# EAGLE design JustStupid (EAGLE 9.3.2)
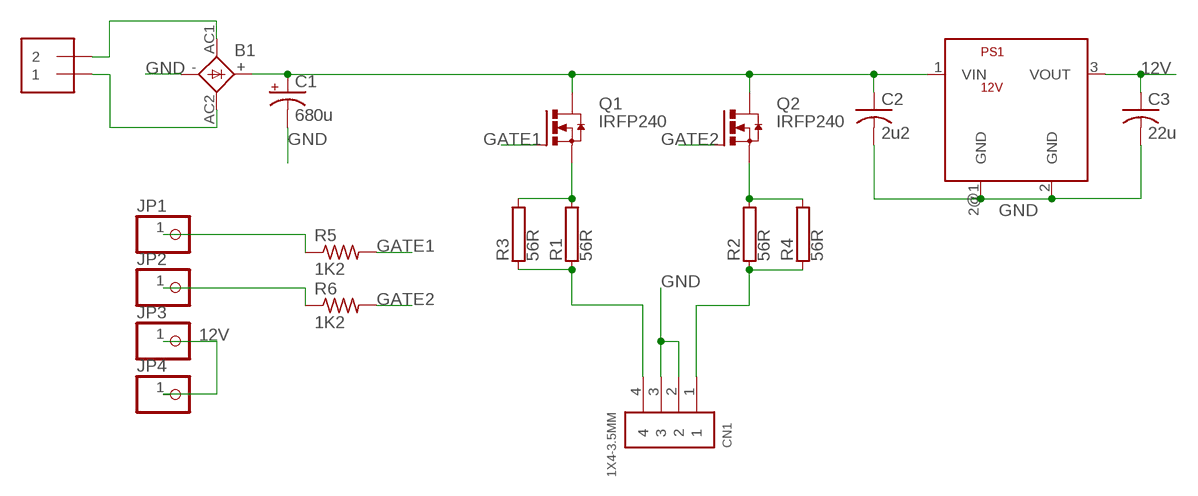
[diagram p0: schematic, sheet 1]

## Parts
ACIN  1X2-3.5MM  [1X2-3.5MM]
B1  KBU  [KBU]
C1  680u  C_POL  [PCPIN_CAP]
C2  2u2  C-USC2220K  [C2220K]
C3  22u  C-USC1206  [C1206]
CN1  1X4-3.5MM  [1X04-3.5MM]
JP1  PINHD-1X1  [1X01]
JP2  PINHD-1X1  [1X01]
JP3  PINHD-1X1  [1X01]
JP4  PINHD-1X1  [1X01]
PS1  12V  NCP785A  [SOT89]
Q1  IRFP240  [TO247BV]
Q2  IRFP240  [TO247BV]
R1  56R  RMG100-V  [TO-247-2V]
R2  56R  RMG100-V  [TO-247-2V]
R3  56R  RMG100-V  [TO-247-2V]
R4  56R  RMG100-V  [TO-247-2V]
R5  1K2  R-US_R1206  [R1206]
R6  1K2  R-US_R1206  [R1206]

## Nets
12V: C3.1 JP3.1 JP4.1 PS1.3(VOUT)
GATE1: Q1.G R5.2
GATE2: Q2.G R6.2
GND [pwr]: B1.- C1.P$1(-) C2.2 C3.2 CN1.2 CN1.3 PS1.2(GND) PS1.2@1(GND)
N$1 [pwr]: ACIN.1 B1.AC2
N$2 [pwr]: ACIN.2 B1.AC1
N$3 [pwr]: B1.+ C1.P$2(+) C2.1 PS1.1(VIN) Q1.D Q2.D
N$4: JP1.1 R5.1
N$5 [pwr]: CN1.4 R1.1 R3.1
N$6 [pwr]: CN1.1 R2.1 R4.1
N$7 [pwr]: Q1.S R1.2 R3.2
N$8 [pwr]: Q2.S R2.2 R4.2
N$9: JP2.1 R6.1

## Library data of the parts
ACIN = adafruit:1X2: 3.5mm Terminal block http://www.ladyada.net/library/pcb/eaglelibrary.html
B1 = rectifier:KBU: DIOTEC RECTIFIER
C1 = TEMP:C_POL
C2 C3 = adafruit:C-US: CAPACITOR, American symbol
CN1 = adafruit:1X4: 4-pin connector
JP1-JP4 = adafruit:PINHD-1X1: Pin header 1x1 for 0.1" spacing With round pins
PS1 = TEMP:NCP785A
Q1 Q2 = transistor-power:IRFP240: HEXFET Power MosFet Source: http://www.irf.com/
R1-R4 = resistor-power:RMG100: TO-247 Power Resistor - RMG 100 Series Source: www.token.com.tw .. power-resistor-rmg100pdf; OC_FARNELL: unknown; OC_NEWARK: unknown
R5 R6 = adafruit:R-US_: RESISTOR, American symbol

## Net classes
1 pwr: width 0.635 mm, drill 0.203 mm, clearance 0.381 mm

## Board
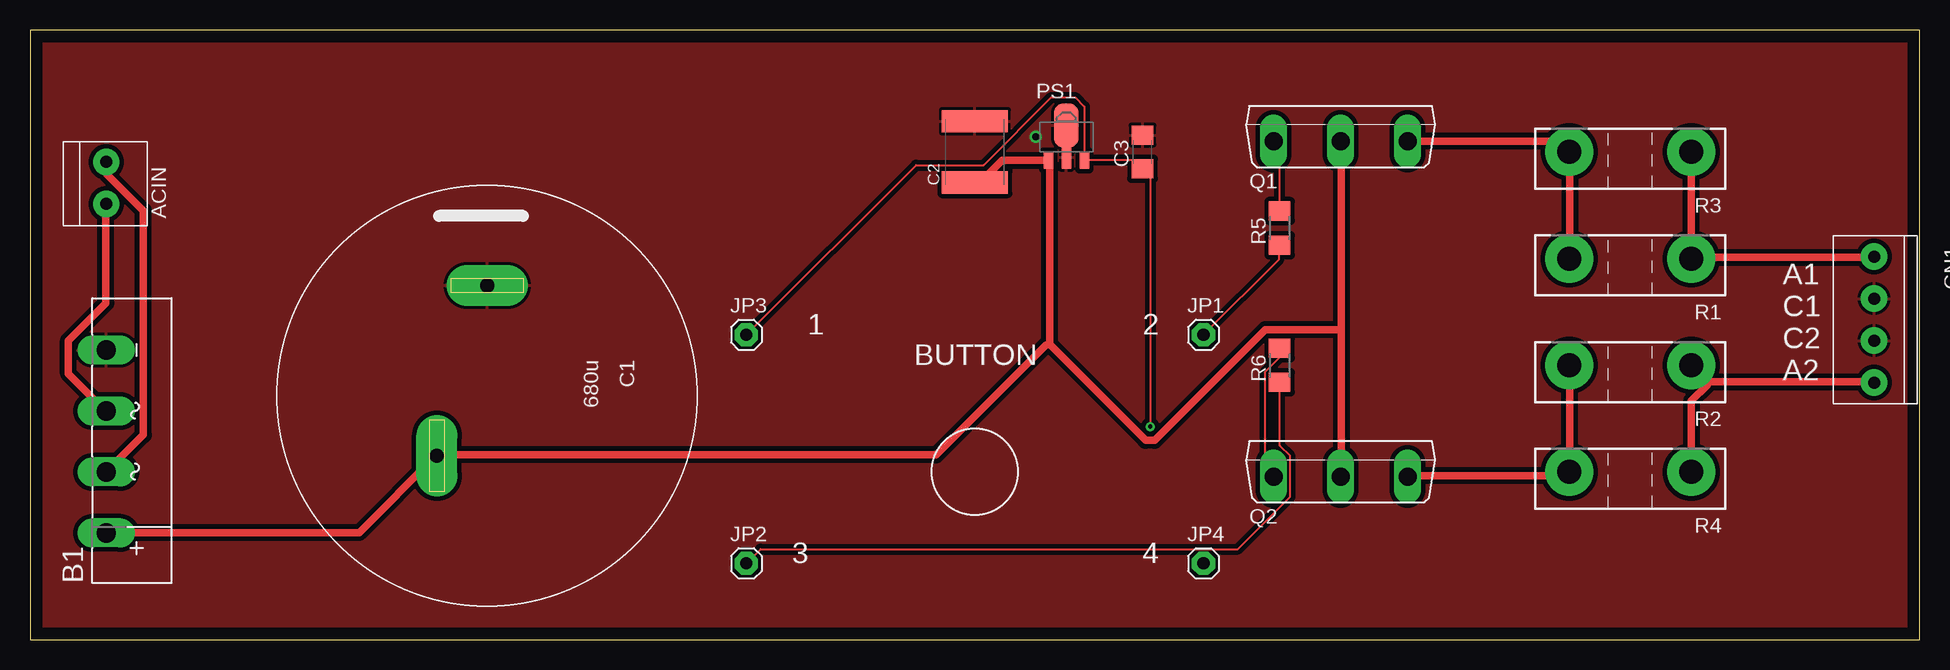
[diagram p1: board, top side]
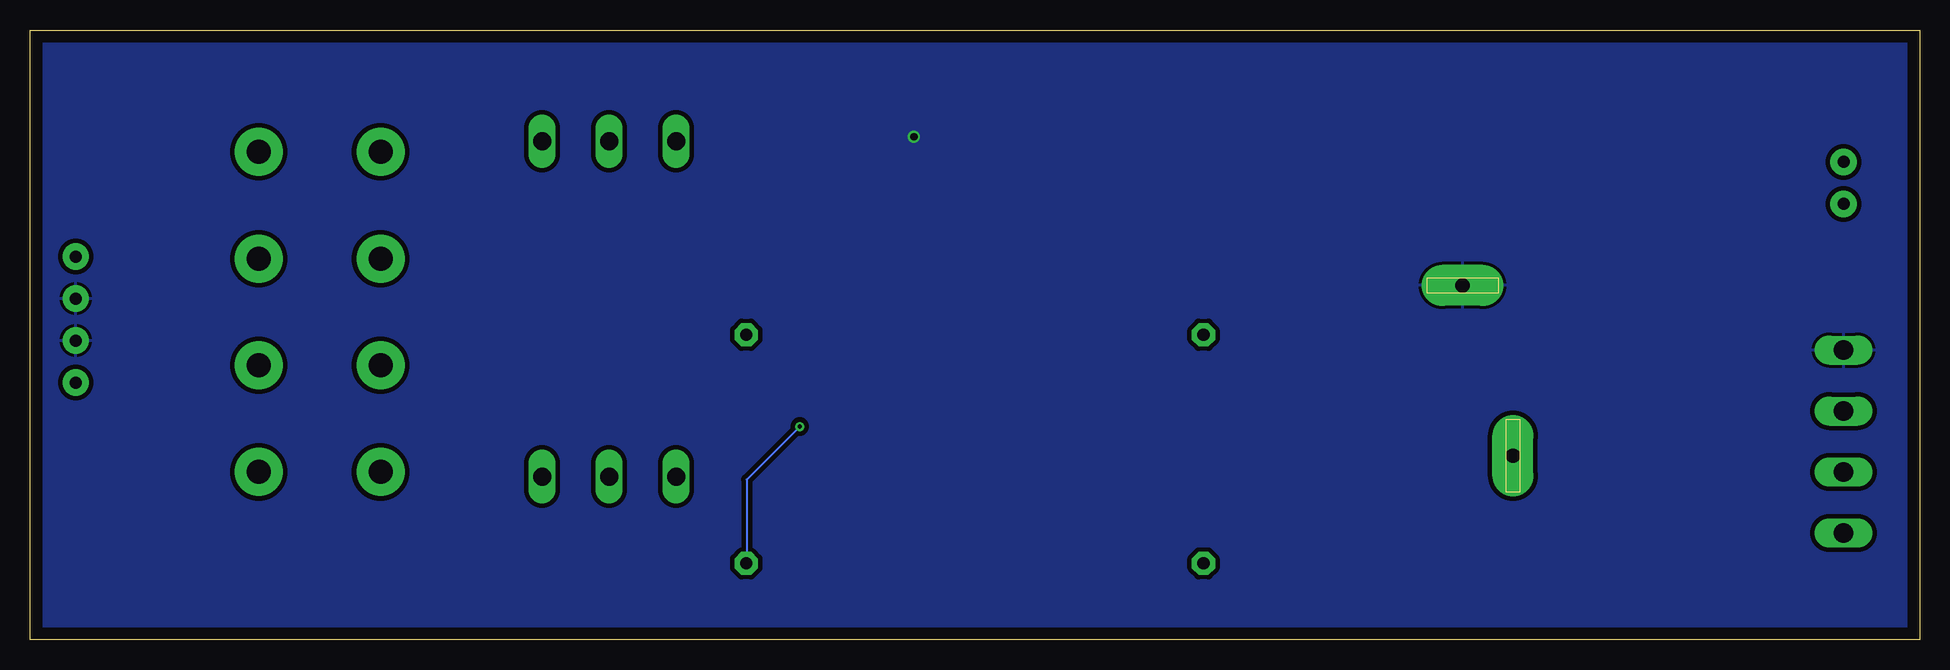
[diagram p2: board, bottom side, seen from below]

Size 157.48 x 50.8 mm. Coordinates in mm from the lower left corner, seen from the top.
Outline: 0,0 157.48,0 157.48,50.8 0,50.8 0,0
Copper layers (1*16): Top 0.035mm / dielectric 1.5mm / Bottom 0.035mm
Design rules "default": minimum track width 6mil, minimum drill 0.35mm, track to track 6mil, track to pad 6mil, pad to pad 6mil, via to via 6mil, smd to smd 6mil, copper to edge 40mil, drill to drill 6mil, minimum pad ring 10mil, minimum via ring 8mil, stop-mask expansion 4mil, vias tented up to drill 0mil, thermal gap 10mil

### Footprints (pad centres in the part's own frame; a part is rotated, then mirrored left to right if it is on the bottom)
1X2-3.5MM = drill 1 pad 2.184: 1 1.8,0; 2 -1.7,0
KBU = drill 1.6 long: + -7.62,2.54; - 7.62,2.54; AC1 -2.54,2.54; AC2 2.54,2.54
PCPIN_CAP = drill 1.2 pad 3.4 long: P$1 -9.2,0; P$2 5,-4.2
C2220K = smd 1.85 x 5.5: 1 -2.55,0; 2 2.55,0
C1206 = smd 1.6 x 1.8: 1 -1.4,0; 2 1.4,0
1X04-3.5MM = drill 1 pad 2.184: 1 -5.25,0; 2 -1.75,0; 3 1.75,0; 4 5.25,0
1X01 = drill 1.016 pad 1.93 octagon: 1 0,0
SOT89 = smd 0.8 x 1.4: 1 -1.499,-1.981; 3 1.499,-1.981 | smd 0.8 x 1.9: 2 0,-1.727 | smd 2.032 x 3.65: 2@1 0,0.94
TO247BV = drill 1.499 long: D 0,-2.921; G -5.588,-2.921; S 5.588,-2.921
TO-247-2V = drill 2 pad 4: 1 -5.08,0; 2 5.08,0
R1206 = smd 1.6 x 1.803: 1 -1.422,0; 2 1.422,0

### Placement (x,y rotation side)
ACIN  6.35,38.1 270 top
B1  8.89,16.51 90 top
C1  38.1,20.32 270 top
C2  78.74,40.64 90 top
C3  92.71,40.64 90 top
CN1  153.67,26.67 90 top
JP1  97.79,25.4 0 top
JP2  59.69,6.35 0 top
JP3  59.69,25.4 0 top
JP4  97.79,6.35 0 top
PS1  86.36,41.91 0 top
Q1  109.22,44.45 0 top
Q2  109.22,16.51 0 top
R1  133.35,31.75 180 top
R2  133.35,22.86 180 top
R3  133.35,40.64 180 top
R4  133.35,13.97 180 top
R5  104.14,34.29 90 top
R6  104.14,22.86 90 top

### Tracks (layer width: path | path; a pad name or v marks a point on that pad's centre or on a via)
12V  (via drill 0.35)
  Top 0.152: JP3.1 73.84,39.55 79.48,39.55 85.11,45.19 87.1,45.19 87.86,44.42 87.86,40.01 PS1.3 87.94,39.93 91.97,39.93 92.66,39.24 C3.1 92.73,39.17 93.34,38.56 v93.34,17.75
  Bottom 0.152: v93.34,17.75 97.77,13.34 97.77,6.4 JP4.1
GATE1
  Top 0.152: Q1.G 104.09,41.07 104.09,35.74 R5.2
GATE2
  Top 0.152: R6.2 104.09,24.23 104.09,23.47 102.95,22.33 102.95,14.33 103.63,13.64 Q2.G
GND  (via drill 0.6)
  other vias: 83.82,41.91
  pour Top: 0,0 0,50.8 157.48,50.8 157.48,0
  pour Bottom: 0,0 0,50.8 157.48,50.8 157.48,0
N$1
  Top 0.635: ACIN.1 6.33,36.27 6.33,28.04 3.2,24.92 3.2,22.17 6.33,19.05 B1.AC2
N$2
  Top 0.635: B1.AC1 9.45,17.07 9.45,35.74 6.4,38.79 6.4,39.78 ACIN.2
N$3
  Top 0.635: B1.+ 6.4,8.91 27.43,8.91 33.83,15.32 C1.P$2 34.21,15.39 75.51,15.39 84.66,24.54 84.96,24.61 | C2.1 78.79,38.1 79.17,38.1 81,39.93 84.81,39.93 PS1.1 84.96,39.62 84.96,24.61 | 109.27,25.83 109.27,41.53 Q1.D | 109.27,25.83 109.27,13.64 Q2.D | 84.96,24.61 92.96,16.61 93.73,16.61 102.95,25.83 109.27,25.83
N$4
  Top 0.152: JP1.1 104.09,31.7 104.09,32.84 R5.1
N$5
  Top 0.635: CN1.4 153.62,31.85 138.53,31.85 R1.1 138.46,32.16 138.46,40.62 R3.1
N$6
  Top 0.635: 139.83,21.49 153.62,21.49 CN1.1 | 139.83,21.49 138.46,22.86 R2.1 | R4.1 138.46,14.02 138.46,19.89 139.75,21.18 139.83,21.49
N$7
  Top 0.635: Q1.S 127.41,41.53 128.25,40.69 R3.2 128.32,40.39 128.32,31.77 R1.2
N$8
  Top 0.635: Q2.S 114.83,13.64 127.94,13.64 R4.2 128.32,14.25 128.32,22.86 R2.2
N$9
  Top 0.152: JP2.1 60.88,7.54 100.66,7.54 105,11.89 105,15.32 104.17,16.15 104.17,21.41 R6.1

### Text on the board
tPlace: 1 | 2 | BUTTON | A1 / C1 / C2 / A2 | 3 | 4